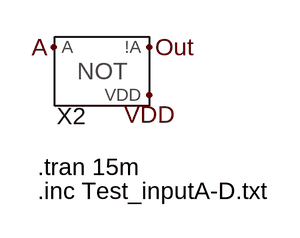
[diagram p0: schematic Test_NOT.asc]
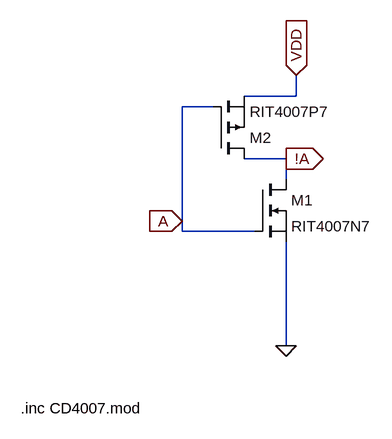
[diagram p1: sub-circuit gate_not.asc]
Test_NOT.asc, the LTspice schematic file:
Version 4
SHEET 1 880 680
FLAG 64 176 Out
FLAG -32 176 A
FLAG 64 224 VDD
SYMBOL Gate_NOT 16 208 R0
SYMATTR InstName X2
TEXT -48 296 Left 2 !.tran 15m
TEXT -48 320 Left 2 !.inc Test_inputA-D.txt

gate_not.asc, the sub-circuit schematic file:
Version 4
SHEET 1 880 680
WIRE 64 -112 64 -144
WIRE 64 -112 -16 -112
WIRE -64 -96 -112 -96
WIRE 48 -16 -16 -16
WIRE 48 16 48 -16
WIRE -112 80 -112 -96
WIRE -112 96 -112 80
WIRE 0 96 -112 96
WIRE 48 272 48 112
FLAG 48 272 0
FLAG -112 80 A
IOPIN -112 80 In
FLAG 48 -16 !A
IOPIN 48 -16 Out
FLAG 64 -144 VDD
IOPIN 64 -144 In
SYMBOL nmos 0 16 R0
SYMATTR InstName M1
SYMATTR Value RIT4007N7
SYMBOL pmos -64 -16 M180
SYMATTR InstName M2
SYMATTR Value RIT4007P7
TEXT -360 368 Left 2 !.inc CD4007.mod

The netlist it stands for:
* Test_NOT.asc
XX2 A VDD Out gate_not

* block symbol definitions
.subckt gate_not A VDD !A
M1 !A A 0 0 RIT4007N7
M2 !A A VDD VDD RIT4007P7
.inc CD4007.mod
.ends gate_not

.model NMOS NMOS
.model PMOS PMOS
.lib standard.mos
.tran 15m
.inc Test_inputA-D.txt
.backanno
.end